# Altium schematic sheet IMU.SchDoc: Capteur inertiel
size Letter; Organization: Robocup Ulaval; DocumentNumber: 6; Revision: 1.0; SheetNumber: 6; SheetTotal: 10; Version: Gamma 1.0; Conceptor: Philippe T. Simon B. Léonard G. Alexia B-L.
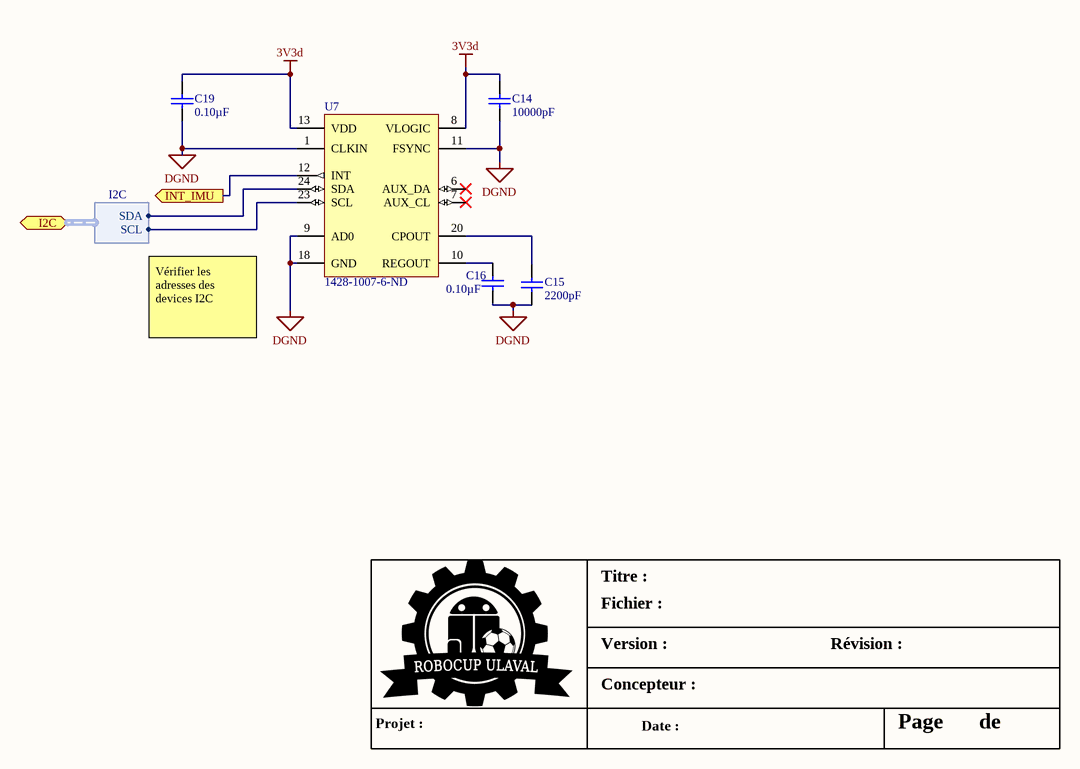
[diagram p0: IMU.SchDoc]

## Parts
C14  Capacitance: 10000pF  [0603]  (hidden comment: GRM188R71H103KA01D)
C15  Capacitance: 2200pF  [0603]  (hidden comment: CL10B222KB8SFNC)
C16  Capacitance: 0.10µF  [0603]  (hidden comment: CL10B104KB8SFNC)
C19  Capacitance: 0.10µF  [0603]  (hidden comment: CL10B104KB8SFNC)
U7  Supplier Part Number 1: 1428-1007-6-ND  [VQFN-24]  (hidden comment: MPU-6050)

## Ports
I2C (harness I2C), INT_IMU (out)

## Harnesses
I2C: SCL, SDA

## Nets
3V3d: C14.2 C19.2 U7.8(VLOGIC) U7.13(VDD)
DGND: C14.1 C15.1 C16.1 C19.1 U7.1(CLKIN) U7.9(AD0) U7.11(FSYNC) U7.18(GND)
INT_IMU: U7.12(INT) ; port INT_IMU
NetC15_2: C15.2 U7.20(CPOUT)
NetC16_2: C16.2 U7.10(REGOUT)
NetU7_23: U7.23(SCL) ; port I2C.SCL
NetU7_24: U7.24(SDA) ; port I2C.SDA

Not connected (* = marked no-connect by the designer): U7 6(AUX_DA)* 7(AUX_CL)*

## Notes on the sheet
- Vérifier les adresses des devices I2C
- Titre :
- Version :
- Fichier :
- Révision :
- Projet :
- Concepteur :
- Date :
- Page
- de

## Library data of the parts
C14 = GRM188R71H103KA01D: CAP CER 10000PF 50V X7R 0603; Manufacturer: Murata Electronics North America; Tolerance: ±10%; Supplier 1: Digi-Key; Manufacturer Part Number: GRM188R71H103KA01D; RoHS: RoHS Compliant; Category: Capacitors; Stock 1: 3064909; Pricing 1: 1=0.14, 10=0.027, 50=0.0142, 100=0.0121, 250=0.00988, 500=0.00848, 1000=0.00661 (CAD); Packaging: Cut Tape (CT); Voltage - Rated: 50V; Temperature Coefficient: X7R; Mounting Type: Surface Mount, MLCC; Operating Temperature: -55°C ~ 125°C; Applications: General Purpose; Ratings: -; Package / Case: 0603 (1608 Metric); Size / Dimension: 0.063" L x 0.031" W (1.60mm x 0.80mm); Height - Seated (Max): -; Thickness (Max): 0.035" (0.90mm); Lead Spacing: -; Features: -; Lead Style: -; ComponentLink1URL: http://www.murata.com/~/media/webrenewal/support/library/catalog/products/capacitor/mlcc/c02e.pdf; ComponentLink1Description: http://www.murata.com/~/media/webrenewal/support/library/catalog/products/capacitor/mlcc/c02e.pdf; Supplier Part Number 1: 490-1512-1-ND
C15 = CL10B222KB8SFNC: CAP CER 2200PF 50V X7R 0603; Manufacturer: Samsung Electro-Mechanics America, Inc.; Tolerance: ±10%; Supplier 1: Digi-Key; Manufacturer Part Number: CL10B222KB8SFNC; RoHS: RoHS Compliant; Category: Capacitors; Stock 1: 52876; Pricing 1: 1=0.14, 10=0.041, 25=0.0292, 50=0.0222, 100=0.0188, 500=0.01314, 1000=0.01024 (CAD); Packaging: Cut Tape (CT); Voltage - Rated: 50V; Temperature Coefficient: X7R; Mounting Type: Surface Mount, MLCC; Operating Temperature: -55°C ~ 125°C; Applications: Boardflex Sensitive; Ratings: -; Package / Case: 0603 (1608 Metric); Size / Dimension: 0.063" L x 0.031" W (1.60mm x 0.80mm); Height - Seated (Max): -; Thickness (Max): 0.035" (0.90mm); Lead Spacing: -; Features: Soft Termination; Lead Style: -; ComponentLink1URL: http://www.samsungsem.com/kr/support/product-search/mlcc/CL10B222KB8SFNC.jsp; ComponentLink1Description: http://www.samsungsem.com/kr/support/product-search/mlcc/CL10B222KB8SFNC.jsp; Supplier Part Number 1: 1276-1992-1-ND
C16 C19 = CL10B104KB8SFNC: CAP CER 0.1UF 50V X7R 0603; Manufacturer: Samsung Electro-Mechanics America, Inc.; Tolerance: ±10%; Supplier 1: Digi-Key; Manufacturer Part Number: CL10B104KB8SFNC; RoHS: RoHS Compliant; Category: Capacitors; Packaging: Cut Tape (CT); Voltage - Rated: 50V; Temperature Coefficient: X7R; Mounting Type: Surface Mount, MLCC; Operating Temperature: -55°C ~ 125°C; Applications: Boardflex Sensitive; Ratings: -; Package / Case: 0603 (1608 Metric); Size / Dimension: 0.063" L x 0.031" W (1.60mm x 0.80mm); Height - Seated (Max): -; Thickness (Max): 0.035" (0.90mm); Lead Spacing: -; Features: Soft Termination; Lead Style: -; ComponentLink1URL: http://www.samsungsem.com/kr/support/product-search/mlcc/CL10B104KB8SFNC.jsp; ComponentLink1Description: http://www.samsungsem.com/kr/support/product-search/mlcc/CL10B104KB8SFNC.jsp; Supplier Part Number 1: 445-173846-1-ND
U7 = MPU-6050: GYRO/ACCELEROMETER 6AXIS 24QFN; Manufacturer: InvenSense; Sensor Type: Accelerometer, Gyroscope, 3 Axis; Output Type: I²C; Supplier 1: Digi-Key; Manufacturer Part Number: MPU-6050; RoHS: RoHS Compliant; Category: Sensors, Transducers; Stock 1: 15335; Pricing 1: 1=11.73, 5=10.282, 10=9.254, 25=8.2264, 50=7.6094, 100=6.5812, 500=6.1699, 1000=5.75857 (CAD); Operating Temperature: -40°C ~ 85°C (TA); ComponentLink1URL: http://store.invensense.com/datasheets/invensense/MPU-6050_DataSheet_V3%204.pdf; ComponentLink1Description: http://store.invensense.com/datasheets/invensense/MPU-6050_DataSheet_V3%204.pdf